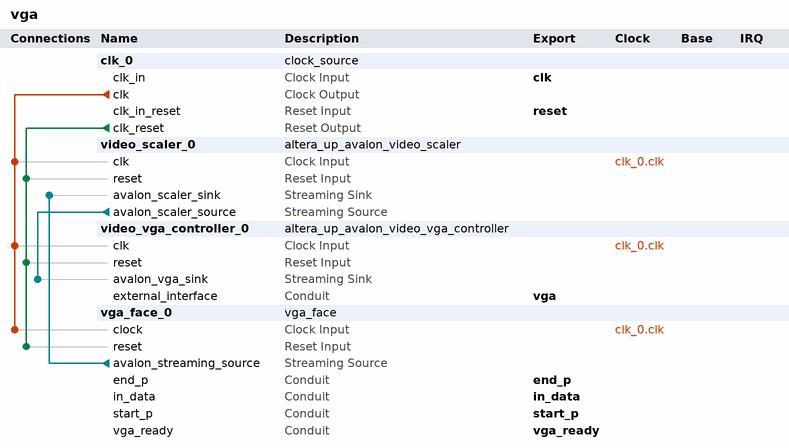
[diagram p0: system contents]
# Platform Designer (Qsys) system vga, Cyclone IV E EP4CE115F29C7
# Parameters at their usual value, and those the tool derives, are not listed.
package require -exact qsys 18.0
create_system vga
set_project_property DEVICE_FAMILY {Cyclone IV E}
set_project_property DEVICE EP4CE115F29C7

add_instance clk_0 clock_source 20.1
set_instance_parameter_value clk_0 clockFrequency 25000000

add_instance video_scaler_0 altera_up_avalon_video_scaler 18.0
set_instance_parameter_value video_scaler_0 color_bits 10
set_instance_parameter_value video_scaler_0 color_planes 3
set_instance_parameter_value video_scaler_0 height_scaling 2
set_instance_parameter_value video_scaler_0 width_in 320
set_instance_parameter_value video_scaler_0 width_scaling 2

add_instance video_vga_controller_0 altera_up_avalon_video_vga_controller 18.0
set_instance_parameter_value video_vga_controller_0 board DE10-Standard
set_instance_parameter_value video_vga_controller_0 resolution {VGA 640x480}

add_instance vga_face_0 vga_face 1.0

# connections
add_connection clk_0.clk vga_face_0.clock clock
add_connection clk_0.clk video_scaler_0.clk clock
add_connection clk_0.clk video_vga_controller_0.clk clock
add_connection clk_0.clk_reset vga_face_0.reset reset
add_connection clk_0.clk_reset video_scaler_0.reset reset
add_connection clk_0.clk_reset video_vga_controller_0.reset reset
add_connection vga_face_0.avalon_streaming_source video_scaler_0.avalon_scaler_sink avalon_streaming
add_connection video_scaler_0.avalon_scaler_source video_vga_controller_0.avalon_vga_sink avalon_streaming

# exported interfaces
add_interface clk clock sink
set_interface_property clk EXPORT_OF clk_0.clk_in
add_interface end_p conduit end
set_interface_property end_p EXPORT_OF vga_face_0.end_p
add_interface in_data conduit end
set_interface_property in_data EXPORT_OF vga_face_0.in_data
add_interface reset reset sink
set_interface_property reset EXPORT_OF clk_0.clk_in_reset
add_interface start_p conduit end
set_interface_property start_p EXPORT_OF vga_face_0.start_p
add_interface vga conduit end
set_interface_property vga EXPORT_OF video_vga_controller_0.external_interface
add_interface vga_ready conduit end
set_interface_property vga_ready EXPORT_OF vga_face_0.vga_ready

set_interconnect_requirement {$system} qsys_mm.clockCrossingAdapter HANDSHAKE
set_interconnect_requirement {$system} qsys_mm.enableEccProtection FALSE
set_interconnect_requirement {$system} qsys_mm.insertDefaultSlave FALSE
set_interconnect_requirement {$system} qsys_mm.maxAdditionalLatency 1

save_system vga.qsys
